# Altium schematic sheet 最新说明.SchDoc
size A4
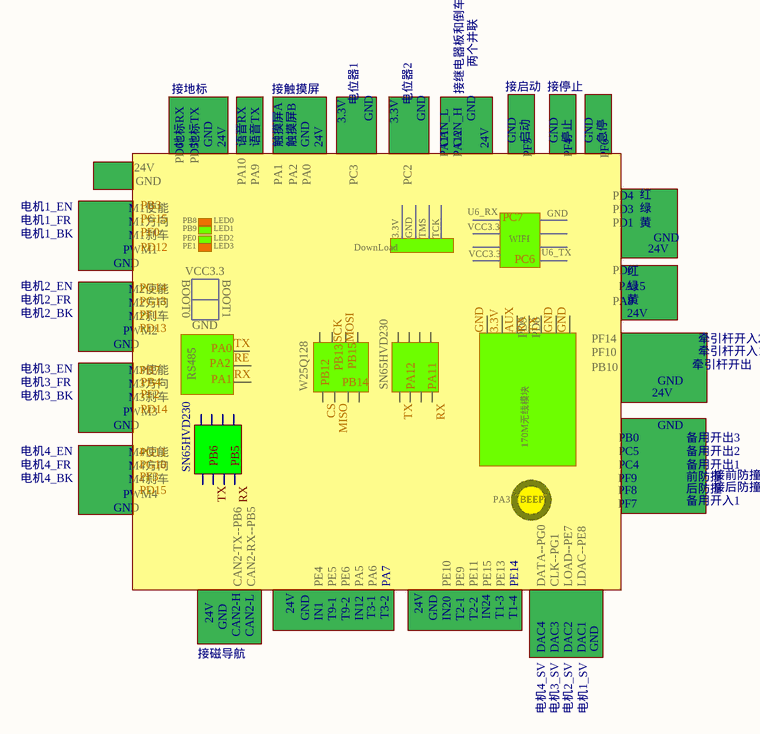
[diagram p0: 最新说明.SchDoc]

## Notes on the sheet
- 接地标
- 接触摸屏
- 电位器1
- 电位器2
- 接继电器板和倒车雷达板
- 两个并联
- 接启动
- 接停止
- 24V
- 地标RX
- PD6
- 地标TX
- PD5
- GND
- 语音RX
- PA10
- 语音TX
- PA9
- PA1
- 触摸屏A
- 触摸屏B
- PA2
- PA0
- 3.3V
- PC3
- PC2
- CAN_L
- PA11
- CAN_H
- PA12
- 启动
- PF5
- 停止
- PF4
- 急停
- PF6
- 电机1_EN
- 电机1_FR
- 电机1_BK
- M1使能
- M1方向
- M1刹车
- PB8
- PB9
- PE1
- PE0
- LED0
- LED1
- LED2
- LED3
- DownLoad
- TMS
- TCK
- U6_RX
- VCC3.3
- WIFI
- PD3
- PD4
- PD1
- 红
- 绿
- 黄
- 电机2_EN
- 电机2_FR
- 电机2_BK
- PWM1
- M2使能
- M2方向
- BOOT0
- BOOT1
- U6_TX
- PD0
- PA8
- PA15
- 电机3_EN
- 电机3_FR
- PWM2
- M2刹车
- M3使能
- RS485
- SN65HVD230
- PD9
- PD8
- PB10
- PF10
- PF14
- 牵引杆开出
- 牵引杆开入2
- 牵引杆开入1
- 电机3_BK
- PWM3
- M3方向
- M3刹车
- W25Q128
- 170M无线模块
- PB0
- 备用开出3
- 电机4_EN
- 电机4_FR
- 电机4_BK
- PWM4
- M4使能
- M4方向
- M4刹车
- PA3
- BEEP
- PF8
- PF9
- PF7
- PC4
- PC5
- 备用开入1
- 备用开出1
- 备用开出2
- 后防撞
- 前防撞
- 接前防撞
- 接后防撞
- CAN2-TX--PB6
- CAN2-RX--PB5
- PE4
- PE5
- PE6
- PA5
- PA6
- PA7
- PE10
- PE9
- PE11
- PE15
- PE13
- PE14
- DATA--PG0
- CLK--PG1
- LOAD--PE7
- LDAC--PE8
- CAN2-H
- CAN2-L
- IN1
- T9-1
- T9-2
- IN12
- T3-1
- T3-2
- IN20
- T2-1
- T2-2
- IN24
- T1-3
- T1-4
- DAC4
- DAC3
- DAC2
- DAC1
- 接磁导航
- 电机4_SV
- 电机3_SV
- 电机2_SV
- 电机1_SV
- Labels drawn without touching a wire or pin: PA0, PA1, PA2, PA11, PA12, PB3, PB4, PB5, PB6, PB7, PB12, PB13, PB14, PB15, PC6, PC7, PD12, PD13, PD14, PD15, PF0, PF1, PF2, PF3, PG10, PG11, PG13, PG14, PG15